# EAGLE design icom_band_decoder (EAGLE 7.2.0)
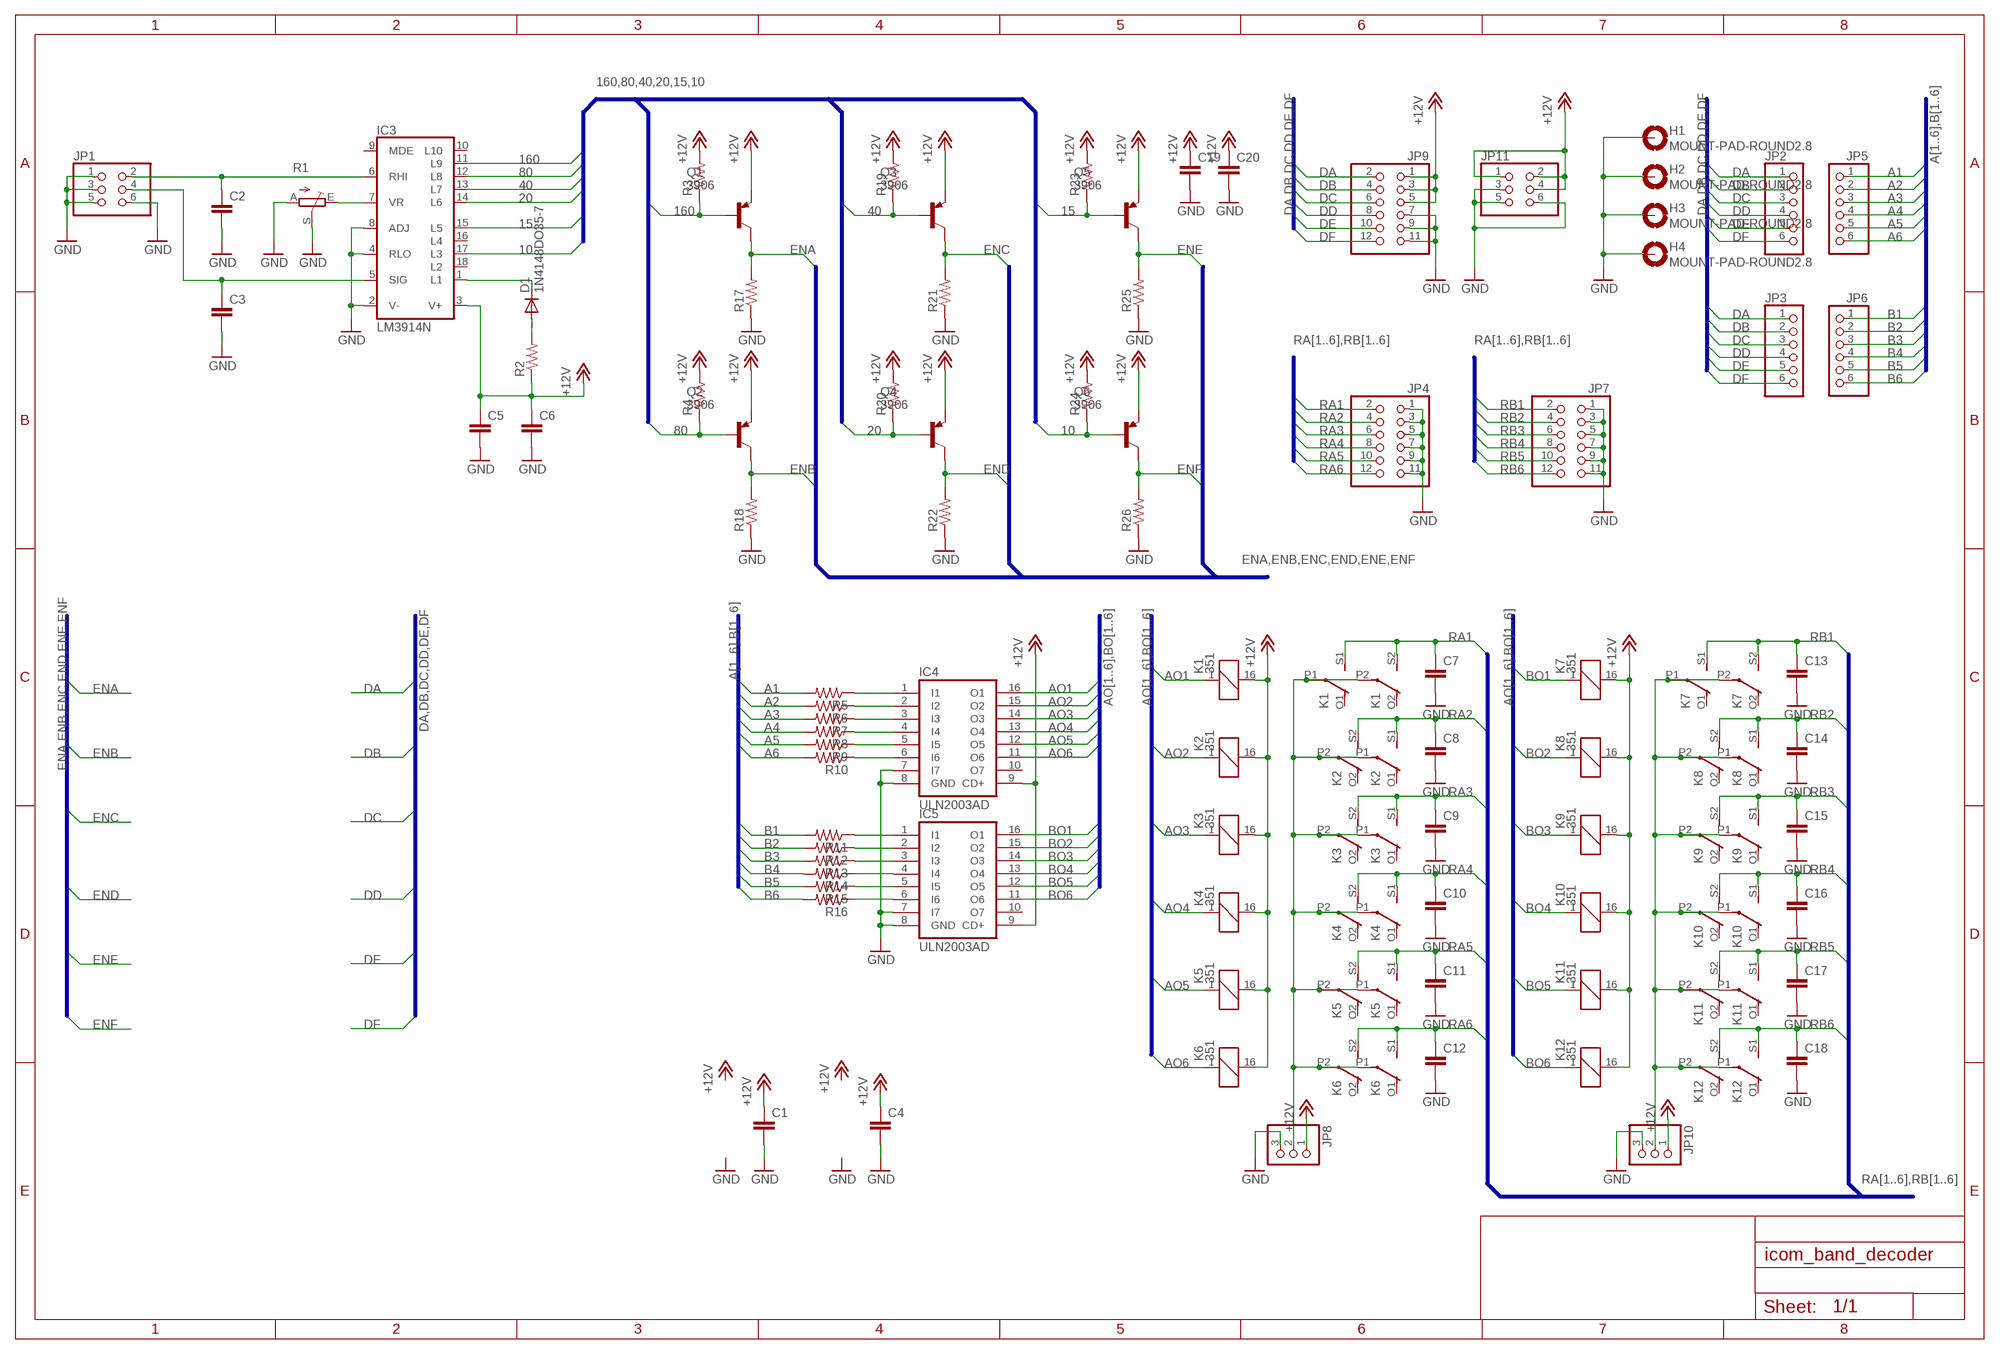
[diagram p0: schematic, sheet 1]

## Parts
C1  C-EU050-024X044  [C050-024X044]
C2  C-EUC0805K  [C0805K]
C3  C-EUC0805K  [C0805K]
C4  C-EU050-024X044  [C050-024X044]
C5  C-EUC0805K  [C0805K]
C6  C-EU050-024X044  [C050-024X044]
C7  C-EU050-024X044  [C050-024X044]
C8  C-EU050-024X044  [C050-024X044]
C9  C-EU050-024X044  [C050-024X044]
C10  C-EU050-024X044  [C050-024X044]
C11  C-EU050-024X044  [C050-024X044]
C12  C-EU050-024X044  [C050-024X044]
C13  C-EU050-024X044  [C050-024X044]
C14  C-EU050-024X044  [C050-024X044]
C15  C-EU050-024X044  [C050-024X044]
C16  C-EU050-024X044  [C050-024X044]
C17  C-EU050-024X044  [C050-024X044]
C18  C-EU050-024X044  [C050-024X044]
C19  C-EU050-024X044  [C050-024X044]
C20  C-EU050-024X044  [C050-024X044]
D1  1N4148DO35-7  [DO35-7]
H1  MOUNT-PAD-ROUND2.8  [2,8-PAD]
H2  MOUNT-PAD-ROUND2.8  [2,8-PAD]
H3  MOUNT-PAD-ROUND2.8  [2,8-PAD]
H4  MOUNT-PAD-ROUND2.8  [2,8-PAD]
IC3  LM3914N  [DIL18]
IC4  ULN2003AD  [SO16]
IC5  ULN2003AD  [SO16]
JP1  PINHD-2X3  [2X03]
JP2  PINHD-1X6  [1X06]
JP3  PINHD-1X6  [1X06]
JP4  PINHD-2X6  [2X06]
JP5  PINHD-1X6  [1X06]
JP6  PINHD-1X6  [1X06]
JP7  PINHD-2X6  [2X06]
JP8  PINHD-1X3  [1X03]
JP9  PINHD-2X6  [2X06]
JP10  PINHD-1X3  [1X03]
JP11  PINHD-2X3  [2X03]
K1  351  [351]
K2  351  [351]
K3  351  [351]
K4  351  [351]
K5  351  [351]
K6  351  [351]
K7  351  [351]
K8  351  [351]
K9  351  [351]
K10  351  [351]
K11  351  [351]
K12  351  [351]
Q1  3906  MMBT3906LT1SMD  [SOT23-BEC]
Q2  3906  MMBT3906LT1SMD  [SOT23-BEC]
Q3  3906  MMBT3906LT1SMD  [SOT23-BEC]
Q4  3906  MMBT3906LT1SMD  [SOT23-BEC]
Q5  3906  MMBT3906LT1SMD  [SOT23-BEC]
Q6  3906  MMBT3906LT1SMD  [SOT23-BEC]
R1  TRIM_EU-CA6V  [CA6V]
R2  R-US_M0805  [M0805]
R3  R-US_M0805  [M0805]
R4  R-US_M0805  [M0805]
R5  R-US_M0805  [M0805]
R6  R-US_M0805  [M0805]
R7  R-US_M0805  [M0805]
R8  R-US_M0805  [M0805]
R9  R-US_M0805  [M0805]
R10  R-US_M0805  [M0805]
R11  R-US_M0805  [M0805]
R12  R-US_M0805  [M0805]
R13  R-US_M0805  [M0805]
R14  R-US_M0805  [M0805]
R15  R-US_M0805  [M0805]
R16  R-US_M0805  [M0805]
R17  R-US_M0805  [M0805]
R18  R-US_M0805  [M0805]
R19  R-US_M0805  [M0805]
R20  R-US_M0805  [M0805]
R21  R-US_M0805  [M0805]
R22  R-US_M0805  [M0805]
R23  R-US_M0805  [M0805]
R24  R-US_M0805  [M0805]
R25  R-US_M0805  [M0805]
R26  R-US_M0805  [M0805]

## Nets
10: IC3.17(L3) Q6.B R24.1
15: IC3.15(L5) Q5.B R23.1
20: IC3.14(L6) Q4.B R20.1
40: IC3.13(L7) Q3.B R19.1
80: IC3.12(L8) Q2.B R4.1
160: IC3.11(L9) Q1.B R3.1
+12V: C1.1 C4.1 C5.1 C6.1 C19.1 C20.1 IC3.3(V+) IC4.9(CD+) IC5.9(CD+) JP8.1 JP9.1 JP9.3 JP9.5 JP10.1 JP11.1 JP11.2 JP11.4 K1.16 K2.16 K3.16 K4.16 K5.16 K6.16 K7.16 K8.16 K9.16 K10.16 K11.16 K12.16 Q1.E Q2.E Q3.E Q4.E Q5.E Q6.E R2.1 R3.2 R4.2 R19.2 R20.2 R23.2 R24.2
A1: JP5.1 R5.2
A2: JP5.2 R6.2
A3: JP5.3 R7.2
A4: JP5.4 R8.2
A5: JP5.5 R9.2
A6: JP5.6 R10.2
AO1: IC4.16(O1) K1.1
AO2: IC4.15(O2) K2.1
AO3: IC4.14(O3) K3.1
AO4: IC4.13(O4) K4.1
AO5: IC4.12(O5) K5.1
AO6: IC4.11(O6) K6.1
B1: JP6.1 R11.2
B2: JP6.2 R12.2
B3: JP6.3 R13.2
B4: JP6.4 R14.2
B5: JP6.5 R15.2
B6: JP6.6 R16.2
BO1: IC5.16(O1) K7.1
BO2: IC5.15(O2) K8.1
BO3: IC5.14(O3) K9.1
BO4: IC5.13(O4) K10.1
BO5: IC5.12(O5) K11.1
BO6: IC5.11(O6) K12.1
DA: JP2.1 JP3.1 JP9.2
DB: JP2.2 JP3.2 JP9.4
DC: JP2.3 JP3.3 JP9.6
DD: JP2.4 JP3.4 JP9.8
DE: JP2.5 JP3.5 JP9.10
DF: JP2.6 JP3.6 JP9.12
ENA: Q1.C R17.2
ENB: Q2.C R18.2
ENC: Q3.C R21.2
END: Q4.C R22.2
ENE: Q5.C R25.2
ENF: Q6.C R26.2
GND: C1.2 C2.2 C3.2 C4.2 C5.2 C6.2 C7.2 C8.2 C9.2 C10.2 C11.2 C12.2 C13.2 C14.2 C15.2 C16.2 C17.2 C18.2 C19.2 C20.2 H1.B2,8(MOUNT) H2.B2,8(MOUNT) H3.B2,8(MOUNT) H4.B2,8(MOUNT) IC3.2(V-) IC3.4(RLO) IC3.8(ADJ) IC4.7(I7) IC4.8(GND) IC5.7(I7) IC5.8(GND) JP1.1 JP1.3 JP1.5 JP1.6 JP4.1 JP4.3 JP4.5 JP4.7 JP4.9 JP4.11 JP7.1 JP7.3 JP7.5 JP7.7 JP7.9 JP7.11 JP8.3 JP9.7 JP9.9 JP9.11 JP10.3 JP11.3 JP11.5 JP11.6 R1.A R1.S R17.1 R18.1 R21.1 R22.1 R25.1 R26.1
N$1: C2.1 IC3.6(RHI) JP1.2
N$2: C3.1 IC3.5(SIG) JP1.4
N$5: IC3.7(VR) R1.E
N$7: D1.C IC3.1(L1)
N$8: D1.A R2.2
N$15: IC4.1(I1) R5.1
N$16: IC4.2(I2) R6.1
N$17: IC4.3(I3) R7.1
N$18: IC4.4(I4) R8.1
N$19: IC4.5(I5) R9.1
N$20: IC4.6(I6) R10.1
N$21: IC5.1(I1) R11.1
N$22: JP8.2 K1.P1(2:P) K1.P2(3:P) K2.P1(2:P) K2.P2(3:P) K3.P1(2:P) K3.P2(3:P) K4.P1(2:P) K4.P2(3:P) K5.P1(2:P) K5.P2(3:P) K6.P1(2:P) K6.P2(3:P)
N$23: IC5.2(I2) R12.1
N$24: IC5.3(I3) R13.1
N$25: IC5.4(I4) R14.1
N$26: IC5.5(I5) R15.1
N$27: IC5.6(I6) R16.1
N$28: JP10.2 K7.P1(2:P) K7.P2(3:P) K8.P1(2:P) K8.P2(3:P) K9.P1(2:P) K9.P2(3:P) K10.P1(2:P) K10.P2(3:P) K11.P1(2:P) K11.P2(3:P) K12.P1(2:P) K12.P2(3:P)
RA1: C7.1 JP4.2 K1.S1(2:S) K1.S2(3:S)
RA2: C8.1 JP4.4 K2.S1(2:S) K2.S2(3:S)
RA3: C9.1 JP4.6 K3.S1(2:S) K3.S2(3:S)
RA4: C10.1 JP4.8 K4.S1(2:S) K4.S2(3:S)
RA5: C11.1 JP4.10 K5.S1(2:S) K5.S2(3:S)
RA6: C12.1 JP4.12 K6.S1(2:S) K6.S2(3:S)
RB1: C13.1 JP7.2 K7.S1(2:S) K7.S2(3:S)
RB2: C14.1 JP7.4 K8.S1(2:S) K8.S2(3:S)
RB3: C15.1 JP7.6 K9.S1(2:S) K9.S2(3:S)
RB4: C16.1 JP7.8 K10.S1(2:S) K10.S2(3:S)
RB5: C17.1 JP7.10 K11.S1(2:S) K11.S2(3:S)
RB6: C18.1 JP7.12 K12.S1(2:S) K12.S2(3:S)
Unconnected: IC3.9(MDE) IC3.10(L10) IC3.16(L4) IC3.18(L2) IC4.10(O7) IC5.10(O7) K1.O1(2:O) K1.O2(3:O) K2.O1(2:O) K2.O2(3:O) K3.O1(2:O) K3.O2(3:O) K4.O1(2:O) K4.O2(3:O) K5.O1(2:O) K5.O2(3:O) K6.O1(2:O) K6.O2(3:O) K7.O1(2:O) K7.O2(3:O) K8.O1(2:O) K8.O2(3:O) K9.O1(2:O) K9.O2(3:O) K10.O1(2:O) K10.O2(3:O) K11.O1(2:O) K11.O2(3:O) K12.O1(2:O) K12.O2(3:O)

## Buses
160,80,40,20,15,10
ENA,ENB,ENC,END,ENE,ENF
DA,DB,DC,DD,DE,DF
A[1..6],B[1..6]
AO[1..6],BO[1..6]
RA[1..6],RB[1..6]

## Library data of the parts
C1-C20 = rcl:C-EU: CAPACITOR, European symbol
D1 = diode:1N4148: DIODE high speed (Philips)
H1-H4 = holes:MOUNT-PAD-ROUND: MOUNTING PAD, round
IC3 = linear:LM3914N: LED DRIVER senses analog voltage levels and drives 10 LEDs
IC4 IC5 = uln-udn:ULN2003A: DRIVER ARRAY
JP1 JP11 = pinhead:PINHD-2X3: PIN HEADER
JP2 JP3 JP5 JP6 = pinhead:PINHD-1X6: PIN HEADER
JP4 JP7 JP9 = pinhead:PINHD-2X6: PIN HEADER
JP8 JP10 = pinhead:PINHD-1X3: PIN HEADER
K1-K12 = relay:351: RELAY 2 x switch, Omron; OC_FARNELL: unknown; OC_NEWARK: unknown
Q1-Q6 = transistor-pnp:MMBT3906*: PNP Transistror
R1 = pot:TRIM_EU-: POTENTIOMETER
R2-R26 = rcl:R-US_: RESISTOR, American symbol

## Board
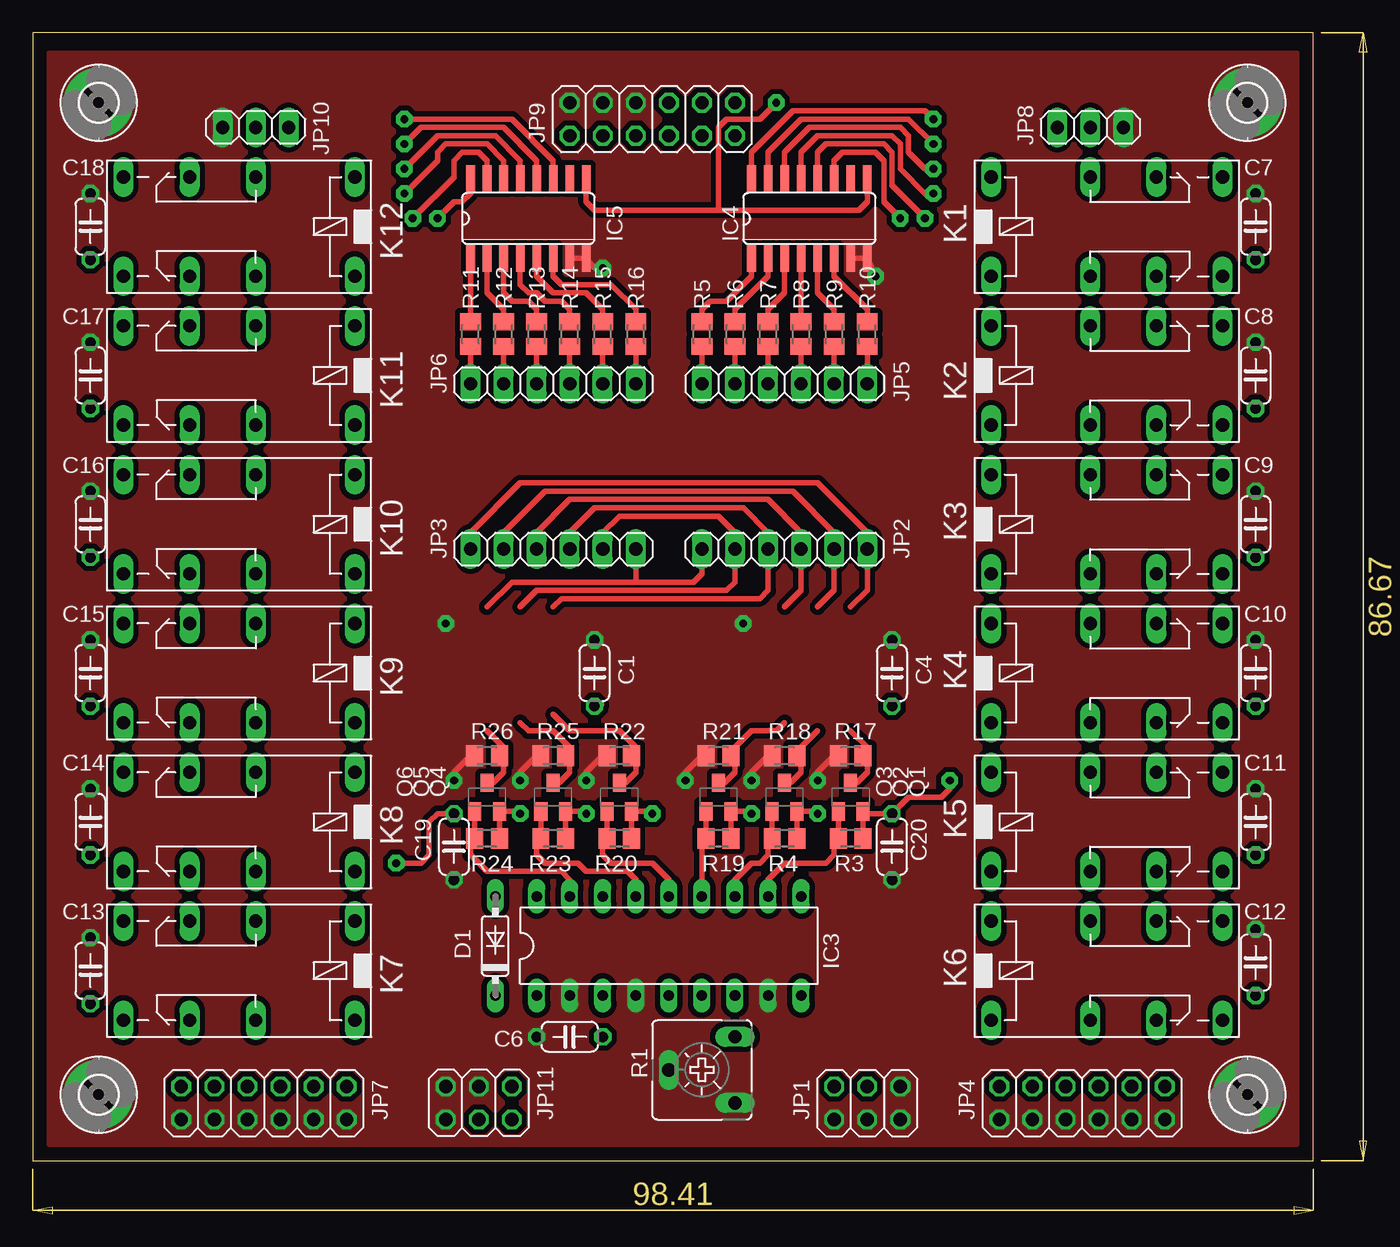
[diagram p1: board, top side]
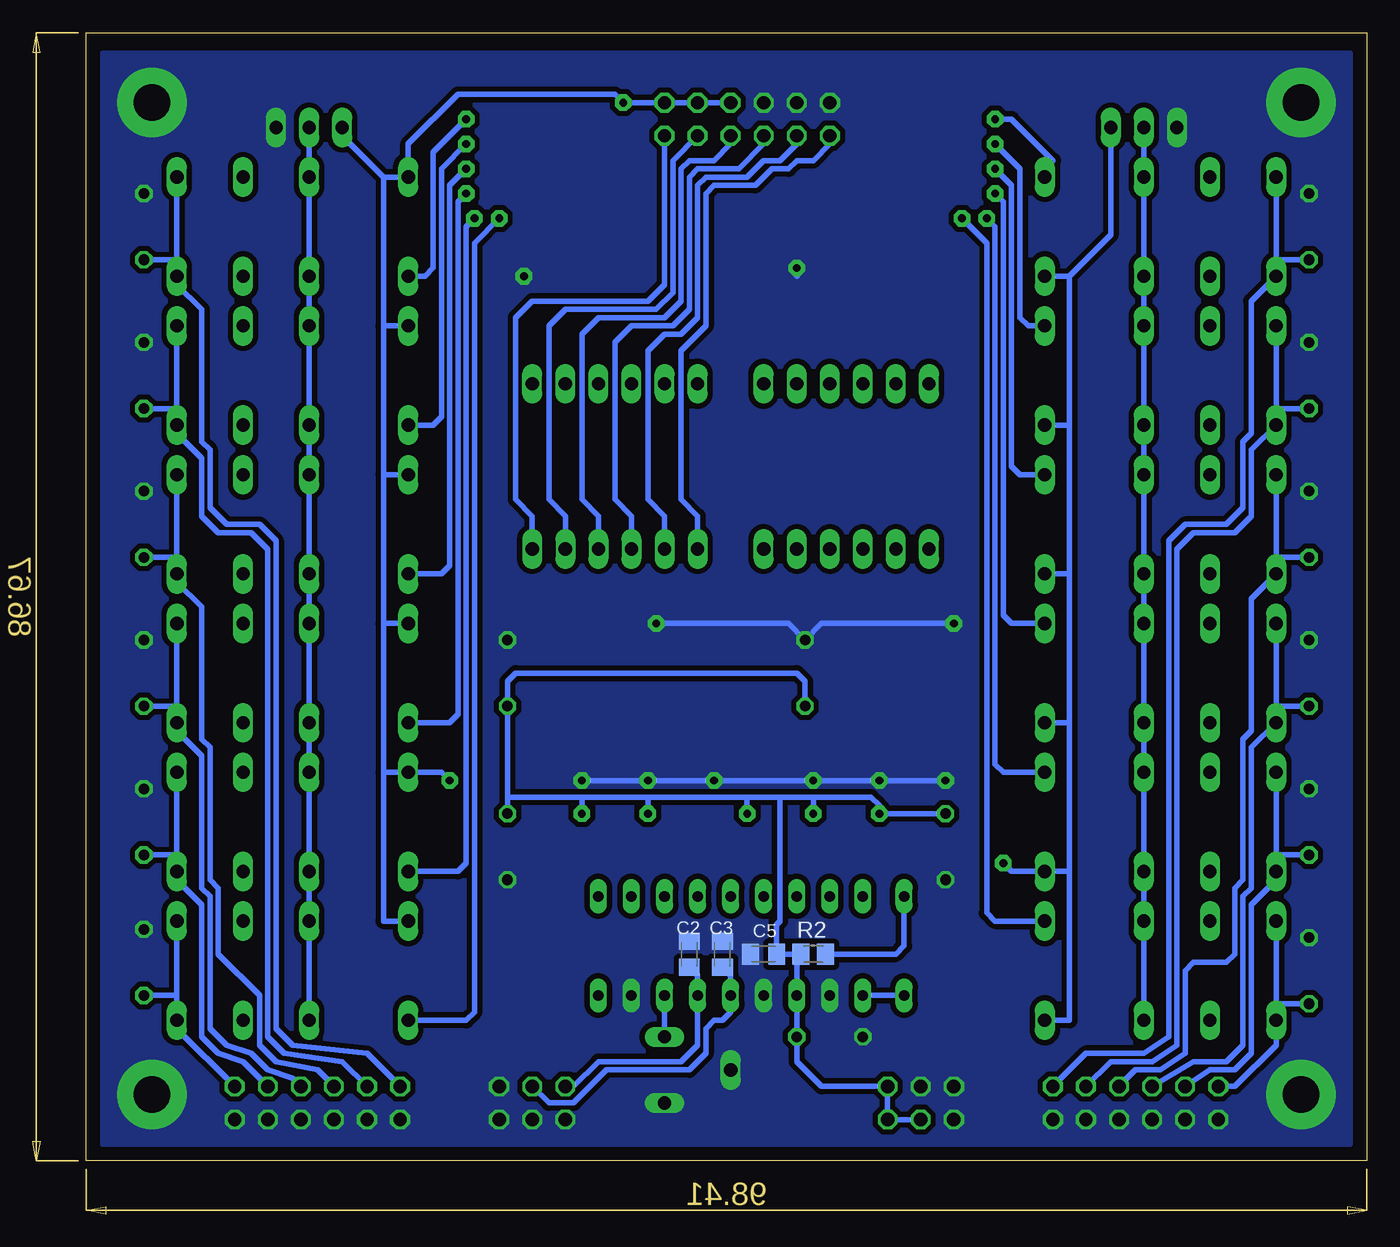
[diagram p2: board, bottom side, seen from below]

Size 98.41 x 86.67 mm. Coordinates in mm from the lower left corner, seen from the top.
Outline: 0,0 98.41,0 98.41,86.67 0,86.67 0,0
Copper layers (1*16): Top 0.035mm / dielectric 1.5mm / Bottom 0.035mm
Design rules "default": minimum track width 10mil, minimum drill 24mil, track to track 8mil, track to pad 8mil, pad to pad 8mil, via to via 8mil, smd to smd 8mil, copper to edge 40mil, drill to drill 8mil, minimum pad ring 10mil, minimum via ring 8mil, stop-mask expansion 4mil, vias tented up to drill 0mil, thermal gap 10mil

### Footprints (pad centres in the part's own frame; a part is rotated, then mirrored left to right if it is on the bottom)
C050-024X044 = drill 0.813 octagon: 1 -2.54,0; 2 2.54,0
C0805K = smd 1.3 x 1.6: 1 -1,0; 2 1,0
DO35-7 = drill 0.813 long: A 3.81,0; C -3.81,0
2,8-PAD = drill 2.8 pad 5.334: B2,8 0,0
DIL18 = drill 0.813 long: 1 -10.16,-3.81; 2 -7.62,-3.81; 3 -5.08,-3.81; 4 -2.54,-3.81; 5 0,-3.81; 6 2.54,-3.81; 7 5.08,-3.81; 8 7.62,-3.81; 9 10.16,-3.81; 10 10.16,3.81; 11 7.62,3.81; 12 5.08,3.81; 13 2.54,3.81; 14 0,3.81; 15 -2.54,3.81; 16 -5.08,3.81; 17 -7.62,3.81; 18 -10.16,3.81
SO16 = smd 0.66 x 2.032: 1 -4.445,-3.073; 2 -3.175,-3.073; 3 -1.905,-3.073; 4 -0.635,-3.073; 5 0.635,-3.073; 6 1.905,-3.073; 7 3.175,-3.073; 8 4.445,-3.073; 9 4.445,3.073; 10 3.175,3.073; 11 1.905,3.073; 12 0.635,3.073; 13 -0.635,3.073; 14 -1.905,3.073; 15 -3.175,3.073; 16 -4.445,3.073
2X03 = drill 1.016 octagon: 1 -2.54,-1.27; 2 -2.54,1.27; 3 0,-1.27; 4 0,1.27; 5 2.54,-1.27; 6 2.54,1.27
1X06 = drill 1.016 long: 1 -6.35,0; 2 -3.81,0; 3 -1.27,0; 4 1.27,0; 5 3.81,0; 6 6.35,0
2X06 = drill 1.016 octagon: 1 -6.35,-1.27; 2 -6.35,1.27; 3 -3.81,-1.27; 4 -3.81,1.27; 5 -1.27,-1.27; 6 -1.27,1.27; 7 1.27,-1.27; 8 1.27,1.27; 9 3.81,-1.27; 10 3.81,1.27; 11 6.35,-1.27; 12 6.35,1.27
1X03 = drill 1.016 long: 1 -2.54,0; 2 0,0; 3 2.54,0
351 = drill 1.016 long: 1 -3.81,-3.81; 16 -3.81,3.81; O1 8.89,-3.81; O2 8.89,3.81; P1 3.81,-3.81; P2 3.81,3.81; S1 13.97,-3.81; S2 13.97,3.81
SOT23-BEC = smd 1 x 1.4: B -0.95,-1.1; C 0,1.1; E 0.95,-1.1
CA6V = drill 1.016 long: A -2.54,-2.54; E 2.54,-2.54; S 0,2.54
M0805 = smd 1.3 x 1.6: 1 -0.95,0; 2 0.95,0

### Placement (x,y rotation side)
C1  43.18,37.47 90 top
C2  52.07,15.88 90 bottom
C3  49.53,15.88 90 bottom
C4  66.04,37.47 90 top
C5  46.35,15.88 180 bottom
C6  41.27,9.53 180 top
C7  93.98,71.75 90 top
C8  93.98,60.33 90 top
C9  93.98,48.9 90 top
C10  93.98,37.47 90 top
C11  93.98,26.04 90 top
C12  93.98,15.24 90 top
C13  4.45,14.61 90 top
C14  4.45,26.04 90 top
C15  4.45,37.47 90 top
C16  4.45,48.9 90 top
C17  4.45,60.33 90 top
C18  4.45,71.75 90 top
C19  32.38,24.13 270 top
C20  66.04,24.13 270 top
D1  35.56,16.51 90 top
H1  5.08,81.28 0 top
H2  93.34,81.28 0 top
H3  5.08,5.08 0 top
H4  93.34,5.08 0 top
IC3  48.9,16.51 0 top
IC4  59.69,72.39 0 top
IC5  38.1,72.39 0 top
JP1  64.14,4.45 0 top
JP2  57.78,46.99 180 top
JP3  40.01,46.99 0 top
JP4  80.64,4.45 0 top
JP5  57.78,59.69 0 top
JP6  40.01,59.69 0 top
JP7  17.78,4.45 0 top
JP8  81.28,79.38 0 top
JP9  47.62,80.01 180 top
JP10  17.14,79.38 180 top
JP11  34.29,4.45 180 top
K1  77.47,71.75 0 top
K2  77.47,60.33 0 top
K3  77.47,48.9 0 top
K4  77.47,37.47 0 top
K5  77.47,26.04 0 top
K6  77.47,14.61 0 top
K7  20.95,14.61 180 top
K8  20.95,26.04 180 top
K9  20.95,37.47 180 top
K10  20.95,48.9 180 top
K11  20.95,60.33 180 top
K12  20.95,71.75 180 top
Q1  62.87,27.94 0 top
Q2  57.78,27.94 0 top
Q3  52.7,27.94 0 top
Q4  45.09,27.94 0 top
Q5  40.01,27.94 0 top
Q6  34.92,27.94 0 top
R1  51.44,6.99 90 top
R2  42.55,15.88 0 bottom
R3  62.87,24.77 0 top
R4  57.78,24.77 0 top
R5  51.44,63.5 270 top
R6  53.98,63.5 270 top
R7  56.52,63.5 270 top
R8  59.05,63.5 270 top
R9  61.59,63.5 270 top
R10  64.14,63.5 270 top
R11  33.66,63.5 270 top
R12  36.2,63.5 270 top
R13  38.73,63.5 270 top
R14  41.27,63.5 270 top
R15  43.81,63.5 270 top
R16  46.35,63.5 270 top
R17  62.87,31.11 0 top
R18  57.78,31.11 0 top
R19  52.7,24.77 0 top
R20  45.09,24.77 0 top
R21  52.7,31.11 0 top
R22  45.09,31.11 0 top
R23  40.01,24.77 0 top
R24  34.92,24.77 0 top
R25  40.01,31.11 0 top
R26  34.92,31.11 0 top

### Tracks (layer width: path | path; a pad name or v marks a point on that pad's centre or on a via)
10
  Top 0.406: Q6.B R24.1 | 34.29,24.45 R24.1 | IC3.17 41.27,21.59 40.64,22.23 34.92,22.23 33.66,23.5 33.66,24.45 R24.1
15
  Top 0.406: Q5.B R23.1 38.73,24.45 38.73,23.5 39.37,22.86 41.91,22.86 42.55,22.23 45.72,22.23 46.35,21.59 IC3.15
20
  Top 0.406: Q4.B R20.1 43.81,24.45 43.81,23.5 44.45,22.86 47.62,22.86 48.9,21.59 IC3.14
40
  Top 0.406: Q3.B R19.1 51.44,24.45 IC3.13
80
  Top 0.406: Q2.B R4.1 56.52,24.45 56.52,23.5 55.88,22.86 55.24,22.86 53.98,21.59 IC3.12
160
  Top 0.406: Q1.B R3.1 61.59,24.45 61.59,23.5 60.96,22.86 57.78,22.86 56.52,21.59 IC3.11
+12V  (via drill 0.6 pad 1.27)
  Top 0.406: R3.2 Q1.E 63.98,26.67 C20.1 67.31,27.94 69.85,27.94 70.48,28.57 v70.48,29.21 | R4.2 Q2.E 60.16,26.84 v60.33,26.67 | R20.2 Q4.E 47.45,26.84 v47.62,26.67 | R23.2 Q5.E 42.38,26.84 v42.55,26.67 | R24.2 Q6.E 37.3,26.84 v37.47,26.67 | R19.2 Q3.E 55.08,26.84 v55.24,26.67 | IC4.9 64.14,73.66 63.5,73.03 52.7,73.03 | 52.7,73.03 43.18,73.03 42.55,73.66 IC5.9 | 43.71,35.03 C1.1 | 65.94,35.03 C4.1 | v57.15,81.28 55.88,80.01 53.34,80.01 52.7,79.38 52.7,73.03 | v27.94,22.86 29.84,22.86 30.48,23.5 30.48,26.04 31.11,26.67 C19.1
  Bottom 0.406: K12.16 22.86,67.94 | 22.86,67.94 22.86,56.52 | 22.86,56.52 22.86,45.09 | 22.86,45.09 22.86,33.66 | 22.86,33.66 22.86,22.23 | 22.86,22.23 22.86,10.79 K7.16 | 22.86,22.23 K8.16 27.3,22.23 v27.94,22.86 | K9.16 22.86,33.66 | K10.16 22.86,45.09 | K11.16 22.86,56.52 | 75.56,75.56 K1.16 73.66,78.11 69.85,81.92 57.78,81.92 v57.15,81.28 JP9.1 JP9.3 JP9.5 | 75.56,75.56 75.56,64.14 | 75.56,64.14 75.56,52.7 | 75.56,52.7 75.56,41.27 | 75.56,41.27 75.56,29.84 | 75.56,29.84 75.56,18.41 K6.16 | 75.56,29.84 K5.16 71.12,29.84 v70.48,29.21 | K4.16 75.56,41.27 | K3.16 75.56,52.7 | K2.16 75.56,64.14 | JP10.1 19.68,71.12 22.86,67.94 | JP8.1 78.74,78.74 75.56,75.56 | 42.55,27.94 38.1,27.94 37.47,27.3 v37.47,26.67 C19.1 | 42.55,27.94 45.09,27.94 | 45.09,27.94 47.62,27.94 | 47.62,27.94 55.24,27.94 | 55.24,27.94 60.33,27.94 | 60.33,27.94 66.04,27.94 | v42.55,26.67 42.55,27.94 | v47.62,26.67 47.62,27.94 | v55.24,26.67 55.24,27.94 | v60.33,26.67 60.33,27.94 | C1.1 43.18,36.83 43.81,37.47 65.41,37.47 66.04,36.83 C4.1 66.04,27.94 | C20.1 66.04,27.94 | 45.09,27.94 45.09,18.41 45.35,18.14 C5.1 R2.1 43.81,15.55 IC3.3 C6.1 43.81,7.62 41.91,5.71 JP11.1 JP11.2 JP11.4
A1
  Top 0.406: JP5.1 R5.2
A2
  Top 0.406: JP5.2 R6.2
A3
  Top 0.406: JP5.3 R7.2
A4
  Top 0.406: JP5.4 R8.2
A5
  Top 0.406: R9.2 JP5.5
A6
  Top 0.406: JP5.6 R10.2
AO1  (via drill 0.6 pad 1.27)
  Top 0.406: IC4.16 55.24,77.47 58.42,80.64 68.58,80.64 v69.22,80.01
  Bottom 0.406: K1.1 72.39,67.94 71.75,68.58 71.75,77.47 v69.22,80.01
AO2  (via drill 0.6 pad 1.27)
  Top 0.406: IC4.15 56.52,77.47 59.05,80.01 67.31,80.01 v69.22,78.11
  Bottom 0.406: v69.22,78.11 71.12,76.2 71.12,57.15 71.75,56.52 K2.1
AO3  (via drill 0.6 pad 1.27)
  Top 0.406: IC4.14 57.78,77.47 59.69,79.38 66.67,79.38 67.31,78.74 67.31,77.47 68.58,76.2 v69.22,76.2
  Bottom 0.406: v69.22,76.2 70.48,74.93 70.48,45.72 71.12,45.09 K3.1
AO4  (via drill 0.6 pad 1.27)
  Top 0.406: IC4.13 59.05,77.47 60.33,78.74 66.04,78.74 66.67,78.11 66.67,76.2 68.58,74.3 v69.22,74.3
  Bottom 0.406: v69.22,74.3 69.85,73.66 69.85,34.29 70.48,33.66 K4.1
AO5  (via drill 0.6 pad 1.27)
  Top 0.406: IC4.12 60.33,77.47 60.96,78.11 65.41,78.11 66.04,77.47 66.04,74.93 v68.58,72.39
  Bottom 0.406: v68.58,72.39 69.22,71.75 69.22,22.86 69.85,22.23 K5.1
AO6  (via drill 0.6 pad 1.27)
  Top 0.406: IC4.11 61.59,76.83 62.23,77.47 64.77,77.47 65.41,76.83 65.41,73.66 v66.67,72.39
  Bottom 0.406: v66.67,72.39 68.58,70.48 68.58,11.43 69.22,10.79 K6.1
B1
  Top 0.406: JP6.1 R11.2
B2
  Top 0.406: JP6.2 R12.2
B3
  Top 0.406: JP6.3 R13.2
B4
  Top 0.406: JP6.4 R14.2
B5
  Top 0.406: JP6.5 R15.2
B6
  Top 0.406: JP6.6 R16.2
BO1  (via drill 0.6 pad 1.27)
  Top 0.406: 33.55,75.56 IC5.16 33.66,74.3 33.02,73.66 32.38,73.66 v31.11,72.39
  Bottom 0.406: v31.11,72.39 29.21,70.48 29.21,19.05 28.57,18.41 K7.1
BO2  (via drill 0.6 pad 1.27)
  Top 0.406: IC5.15 34.92,76.83 34.29,77.47 33.02,77.47 32.38,76.83 32.38,75.56 v29.21,72.39
  Bottom 0.406: v29.21,72.39 28.57,71.75 28.57,30.48 27.94,29.84 K8.1
BO3  (via drill 0.6 pad 1.27)
  Top 0.406: IC5.14 36.2,76.83 34.92,78.11 31.75,78.11 31.11,77.47 31.11,76.83 v28.57,74.3
  Bottom 0.406: v28.57,74.3 27.94,73.66 27.94,41.91 27.3,41.27 K9.1
BO4  (via drill 0.6 pad 1.27)
  Top 0.406: IC5.13 37.47,76.83 35.56,78.74 31.11,78.74 v28.57,76.2
  Bottom 0.406: v28.57,76.2 27.3,74.93 27.3,53.34 26.67,52.7 K10.1
BO5  (via drill 0.6 pad 1.27)
  Top 0.406: IC5.12 38.73,76.83 36.2,79.38 29.84,79.38 v28.57,78.11
  Bottom 0.406: v28.57,78.11 26.67,76.2 26.67,64.77 26.04,64.14 K11.1
BO6  (via drill 0.6 pad 1.27)
  Top 0.406: IC5.11 40.01,76.83 36.83,80.01 v28.57,80.01
  Bottom 0.406: K12.1 24.13,76.83 27.3,80.01 v28.57,80.01
DA
  Top 0.406: 62.87,42.55 64.14,43.81 JP2.1 64.14,48.26 60.33,52.07 37.47,52.07 33.66,48.26 JP3.1
  Bottom 0.406: JP9.2 53.98,67.31 55.24,66.04 64.14,66.04 65.41,64.77 65.41,50.8 64.14,49.53 JP2.1
DB
  Top 0.406: 60.33,42.55 61.59,43.81 JP2.2 61.59,48.26 58.42,51.44 39.37,51.44 36.2,48.26 JP3.2
  Bottom 0.406: JP9.4 53.34,76.83 53.34,66.67 54.61,65.41 61.59,65.41 62.87,64.14 62.87,50.8 61.59,49.53 JP2.2
DC
  Top 0.406: 57.78,42.55 59.05,43.81 JP2.3 59.05,48.26 56.52,50.8 41.27,50.8 38.73,48.26 JP3.3
  Bottom 0.406: JP9.6 48.9,78.11 50.16,76.83 52.07,76.83 52.7,76.2 52.7,66.04 53.98,64.77 59.05,64.77 60.33,63.5 60.33,50.8 59.05,49.53 JP2.3
DD
  Top 0.406: 40.01,42.55 40.64,43.18 55.88,43.18 56.52,43.81 JP2.4 56.52,48.26 54.61,50.16 43.18,50.16 41.27,48.26 JP3.4
  Bottom 0.406: JP9.8 46.35,78.11 48.26,76.2 51.44,76.2 52.07,75.56 52.07,65.41 53.34,64.14 56.52,64.14 57.78,62.87 57.78,50.8 56.52,49.53 JP2.4
DE
  Top 0.406: 37.47,42.55 38.73,43.81 53.34,43.81 53.98,44.45 JP2.5 53.98,48.26 52.7,49.53 45.09,49.53 43.81,48.26 JP3.5
  Bottom 0.406: JP9.10 43.81,78.11 45.09,76.83 46.35,76.83 47.62,75.56 50.8,75.56 51.44,74.93 51.44,64.77 52.7,63.5 53.98,63.5 55.24,62.23 55.24,50.8 53.98,49.53 JP2.5
DF
  Top 0.406: 34.92,42.55 36.83,44.45 46.35,44.45 | 46.35,44.45 50.8,44.45 51.44,45.09 JP2.6 | JP3.6 46.35,44.45
  Bottom 0.406: JP9.12 41.27,78.11 42.55,76.83 43.81,76.83 44.45,76.2 45.72,76.2 46.99,74.93 50.16,74.93 50.8,74.3 50.8,64.14 52.7,62.23 52.7,50.8 51.44,49.53 JP2.6
ENA
  Top 0.406: Q1.C 63.33,29.04 64.14,29.84 64.14,30.8 R17.2 64.14,31.43 64.14,31.75 62.87,33.02
ENB
  Top 0.406: Q2.C 58.25,29.04 59.05,29.84 59.05,30.8 R18.2 59.05,31.43 59.05,31.75 60.33,33.02
ENC
  Top 0.406: Q3.C 53.17,29.04 53.98,29.84 53.98,30.8 R21.2 53.98,31.43 53.98,31.75 55.24,33.02 57.15,33.02 57.78,33.66
END
  Top 0.406: Q4.C 45.55,29.04 46.35,29.84 46.35,30.8 R22.2 46.35,31.43 46.35,31.75 45.09,33.02 41.27,33.02 40.01,34.29
ENE
  Top 0.406: Q5.C 40.47,29.04 41.27,29.84 41.27,30.8 R25.2 41.27,31.43 41.27,31.75 40.01,33.02 38.1,33.02 37.47,33.66
ENF
  Top 0.406: Q6.C 35.39,29.04 36.2,29.84 36.2,30.8 R26.2 36.2,31.43 36.2,31.75 34.92,33.02
GND  (via drill 0.6 pad 1.27)
  Top 0.406: R17.1 61.59,31.11 60.33,29.84 v60.33,29.21 | R18.1 56.52,31.11 55.24,29.84 v55.24,29.21 | R21.1 51.44,31.11 50.16,29.84 v50.16,29.21 | R22.1 43.81,31.11 42.55,29.84 v42.55,29.21 | R25.1 38.73,31.11 37.47,29.84 v37.47,29.21 | R26.1 33.66,31.11 32.38,29.84 v32.38,29.21 | 54.71,41.17 v54.61,41.27 | 31.85,41.17 v31.75,41.27 | IC5.8 IC5.7 42.44,69.32 43.18,68.58 v43.81,68.58 | IC4.7 IC4.8 v64.77,67.94
  Bottom 0.406: v60.33,29.21 v55.24,29.21 v50.16,29.21 v42.55,29.21 v37.47,29.21 v32.38,29.21 | v54.61,41.27 44.45,41.27 C1.2 41.91,41.27 v31.75,41.27 | v43.81,68.58 43.81,67.94
  pour Bottom (isolate 0.406, no thermals): 1.27,85.09 97.16,85.09 97.16,1.27 1.27,1.27
  pour Top (isolate 0.406, no thermals): 1.27,85.09 97.16,85.09 97.16,1.27 1.27,1.27
N$1
  Bottom 0.406: JP1.2 60.96,5.71 59.05,7.62 52.7,7.62 51.44,8.89 IC3.6 51.44,14.24 C2.1
N$2
  Bottom 0.406: C3.1 48.9,14.24 IC3.5 48.9,11.43 49.53,10.79 50.16,10.79 50.8,10.16 50.8,8.26 52.07,6.99 58.42,6.99 60.96,4.45 62.87,4.45 JP1.4
N$5
  Bottom 0.406: IC3.7 R1.E
N$7
  Bottom 0.406: IC3.1 D1.C
N$8
  Bottom 0.406: R2.2 36.2,15.88 35.56,16.51 D1.A
N$15
  Top 0.406: IC4.1 55.24,67.94 53.34,66.04 52.07,66.04 51.44,65.41 R5.1
N$16
  Top 0.406: IC4.2 56.52,67.94 53.98,65.41 R6.1
N$17
  Top 0.406: IC4.3 57.78,66.67 56.52,65.41 R7.1
N$18
  Top 0.406: IC4.4 R8.1
N$19
  Top 0.406: IC4.5 60.33,66.67 61.59,65.41 R9.1
N$20
  Top 0.406: IC4.6 61.59,67.94 64.14,65.41 R10.1
N$21
  Top 0.406: IC5.1 R11.1
N$22
  Bottom 0.406: K6.P1 K6.P2 K5.P1 K5.P2 K4.P1 K4.P2 K3.P1 K3.P2 K2.P1 K2.P2 K1.P1 K1.P2 JP8.2
N$23
  Top 0.406: IC5.2 34.92,66.67 36.2,65.41 R12.1
N$24
  Top 0.406: IC5.3 36.2,66.67 36.83,66.04 38.1,66.04 38.73,65.41 R13.1
N$25
  Top 0.406: IC5.4 37.47,67.31 38.1,66.67 38.73,66.67 39.37,66.04 40.64,66.04 41.27,65.41 R14.1
N$26
  Top 0.406: IC5.5 38.73,67.94 40.01,66.67 42.55,66.67 43.81,65.41 R15.1
N$27
  Top 0.406: IC5.6 40.01,67.94 40.64,67.31 44.45,67.31 46.35,65.41 R16.1
N$28
  Bottom 0.406: K7.P2 K7.P1 K8.P2 K8.P1 K9.P2 K9.P1 K10.P2 K10.P1 K11.P2 K11.P1 K12.P2 K12.P1 JP10.2
RA1
  Bottom 0.406: K1.S2 91.44,69.22 | 91.44,69.22 K1.S1 91.44,67.31 89.53,65.41 89.53,55.24 88.9,54.61 88.9,50.16 87.63,48.9 85.09,48.9 83.82,47.62 83.82,10.16 82.55,8.89 76.83,8.26 JP4.2 | C7.1 91.44,69.22
RA2
  Bottom 0.406: K2.S2 91.44,57.78 | 91.44,57.78 K2.S1 91.44,55.88 89.53,53.98 89.53,49.53 88.27,48.26 85.72,48.26 84.45,46.99 84.45,9.53 83.19,8.26 78.74,7.62 JP4.4 | C8.1 91.44,57.78
RA3
  Bottom 0.406: K3.S2 91.44,46.35 | 91.44,46.35 K3.S1 91.44,44.45 89.53,42.55 89.53,32.38 88.9,31.75 88.9,21.59 88.27,20.95 88.27,15.88 85.09,12.7 85.09,8.89 83.82,7.62 80.64,6.99 JP4.6 | C9.1 91.44,46.35
RA4
  Bottom 0.406: K4.S2 91.44,34.92 | 91.44,34.92 K4.S1 91.44,33.02 89.53,31.11 89.53,20.95 88.9,20.32 88.9,10.16 87.63,8.89 85.72,8.26 84.45,6.99 82.55,6.35 JP4.8 | C10.1 91.44,34.92
RA5
  Bottom 0.406: K5.S2 91.44,23.5 | 91.44,23.5 K5.S1 91.44,21.59 89.53,19.68 89.53,9.53 88.27,8.26 86.36,7.62 JP4.10 | C11.1 91.44,23.5
RA6
  Bottom 0.406: K6.S2 91.44,12.7 | 91.44,12.7 K6.S1 91.44,10.16 JP4.12 | C12.1 91.44,12.7
RB1
  Bottom 0.406: K7.S1 6.99,12.06 | 6.99,12.06 K7.S2 6.99,8.89 10.16,5.71 JP7.2 | C13.1 6.99,12.06
RB2
  Bottom 0.406: K8.S1 6.99,23.5 | 6.99,23.5 K8.S2 6.99,21.59 8.89,19.68 8.89,8.26 10.16,6.99 12.06,6.99 JP7.4 | C14.1 6.99,23.5
RB3
  Bottom 0.406: K9.S1 6.99,34.92 | 6.99,34.92 K9.S2 8.89,31.75 8.89,20.95 9.53,20.32 9.53,8.89 10.79,7.62 13.34,7.62 JP7.6 | C15.1 6.99,34.92
RB4
  Bottom 0.406: K10.S1 6.99,46.35 | 6.99,46.35 K10.S2 8.89,43.18 8.89,33.02 9.53,32.38 9.53,21.59 10.16,20.95 10.16,15.88 10.79,15.24 13.34,15.24 13.97,14.61 13.97,8.26 15.88,6.99 17.78,6.99 JP7.8 | C16.1 6.99,46.35
RB5
  Bottom 0.406: K11.S1 6.99,57.78 | 6.99,57.78 K11.S2 8.89,54.61 8.89,49.53 10.16,48.26 13.34,48.26 14.61,46.99 14.61,8.89 16.51,7.62 19.68,7.62 JP7.10 | C17.1 6.99,57.78
RB6
  Bottom 0.406: K12.S1 6.99,69.22 | 6.99,69.22 K12.S2 8.89,66.04 8.89,55.88 9.53,55.24 9.53,50.16 10.79,48.9 13.97,48.9 15.24,47.62 15.24,9.53 17.14,8.26 21.59,8.26 JP7.12 | C18.1 6.99,69.22